# Altium schematic sheet AP8248.SchDoc
size A4
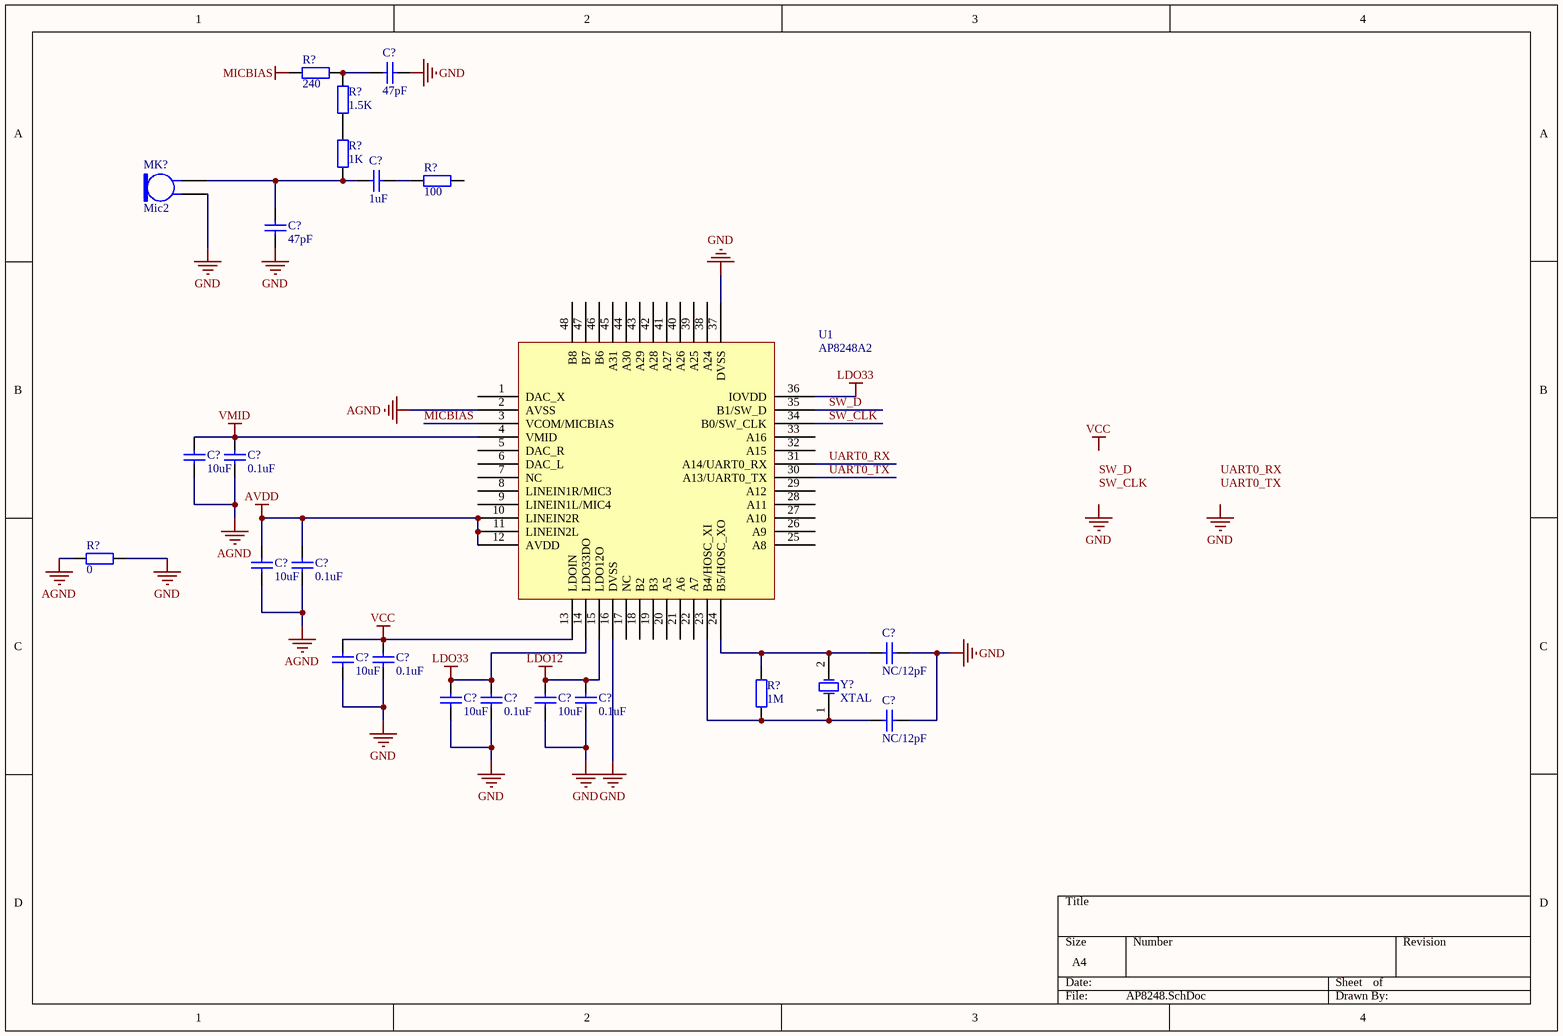
[diagram p0: AP8248.SchDoc]

## Parts
(Parts that share a designator on the sheet are numbered #1, #2 ... from top to bottom, then left to right.)
C?#1  47pF  [0603L]
C?#2  1uF  [0603L]
C?#3  47pF  [0603L]
C?#4  10uF  [0603L]
C?#5  0.1uF  [0603L]
C?#6  10uF  [0603L]
C?#7  0.1uF  [0603L]
C?#8  10uF  [0603L]
C?#9  0.1uF  [0603L]
C?#10  NC/12pF  [0603L]
C?#11  10uF  [0603L]
C?#12  0.1uF  [0603L]
C?#13  10uF  [0603L]
C?#14  0.1uF  [0603L]
C?#15  NC/12pF  [0603L]
MK?  Mic2  [PIN2]
R?#1  240  [0603L]
R?#2  1.5K  [0603L]
R?#3  1K  [0603L]
R?#4  100  [0603L]
R?#5  0  [0603L]
R?#6  1M  [0603L]
U1  AP8248A2
Y?  XTAL  [XTAL0602]

## Nets
AGND: C?#4.1 C?#5.1 C?#6.1 C?#7.1 R?#5.1 U1.2(AVSS)
AVDD: C?#6.2 C?#7.2 U1.10(LINEIN2R) U1.11(LINEIN2L) U1.12(AVDD)
GND: C?#1.1 C?#3.1 C?#8.1 C?#9.1 C?#10.1 C?#11.1 C?#12.1 C?#13.1 C?#14.1 C?#15.1 MK?.1 R?#5.2 U1.16(DVSS) U1.37(DVSS)
LDO12: C?#13.2 C?#14.2 U1.15(LDO12O)
LDO33: C?#11.2 C?#12.2 U1.14(LDO33DO) U1.36(IOVDD)
MICBIAS: R?#1.2 U1.3(VCOM/MICBIAS)
VCC: C?#8.2 C?#9.2 U1.13(LDOIN)
VMID: C?#4.2 C?#5.2 U1.4(VMID)
SW_CLK: U1.34(B0/SW_CLK)
SW_D: U1.35(B1/SW_D)
UART0_RX: U1.31(A14/UART0_RX)
UART0_TX: U1.30(A13/UART0_TX)
NetC?#1_2: C?#1.2 R?#1.1 R?#2.2
NetC?#2_1: C?#2.1 R?#4.2
NetC?#2_2: C?#2.2 C?#3.2 MK?.2 R?#3.1
NetC?#10_2: C?#10.2 R?#6.2 U1.24(B5/HOSC_XO) Y?.2(OSC2)
NetC?#15_2: C?#15.2 R?#6.1 U1.23(B4/HOSC_XI) Y?.1(OSC1)
NetR?#2_1: R?#2.1 R?#3.2

Not connected (* = marked no-connect by the designer): R?#4 1; U1 1(DAC_X) 5(DAC_R) 6(DAC_L) 7(NC) 8(LINEIN1R/MIC3) 9(LINEIN1L/MIC4) 17(NC) 18(B2) 19(B3) 20(A5) 21(A6) 22(A7) 25(A8) 26(A9) 27(A10) 28(A11) 29(A12) 32(A15) 33(A16) 38(A24) 39(A25) 40(A26) 41(A27) 42(A28) 43(A29) 44(A30) 45(A31) 46(B6) 47(B7) 48(B8)

## Notes on the sheet
- Labels drawn without touching a wire or pin: GND, SW_CLK, SW_D, UART0_RX, UART0_TX, VCC

## Library data of the parts
C?#1-C?#15 = Cap: Capacitor; Published: 8-Jun-2000; LatestRevisionDate: 17-Jul-2002; LatestRevisionNote: Re-released for DXP Platform.; PackageReference: RAD-0.3
  C?#1 C?#3: Value: 47pF
  C?#2: Value: 1uF
  C?#4 C?#6 C?#8 C?#11 C?#13: Value: 10uF
  C?#5 C?#7 C?#9 C?#12 C?#14: Value: 0.1uF
  C?#10 C?#15: Value: NC/12pF
MK? = Mic2: Microphone; Published: 24-Mar-1999; LatestRevisionDate: 17-Jul-2002; LatestRevisionNote: Re-released for DXP Platform.; PackageReference: PIN2; Publisher: Altium Limited
R?#1-R?#6 = Res: Resistor; Published: 8-Jun-2000; LatestRevisionDate: 17-Jul-2002; LatestRevisionNote: Re-released for DXP Platform.; PackageReference: AXIAL-0.4; Publisher: Altium Limited
  R?#1: Value: 240
  R?#2: Value: 1.5K
  R?#3: Value: 1K
  R?#4: Value: 100
  R?#5: Value: 0
  R?#6: Value: 1M
Y? = XTAL: Crystal 49S/49SMD/HOLE; Published: 8-Jun-2000; LatestRevisionDate: 17-Jul-2002; LatestRevisionNote: Re-released for DXP Platform.; PackageReference: R38; Publisher: Altium Limited